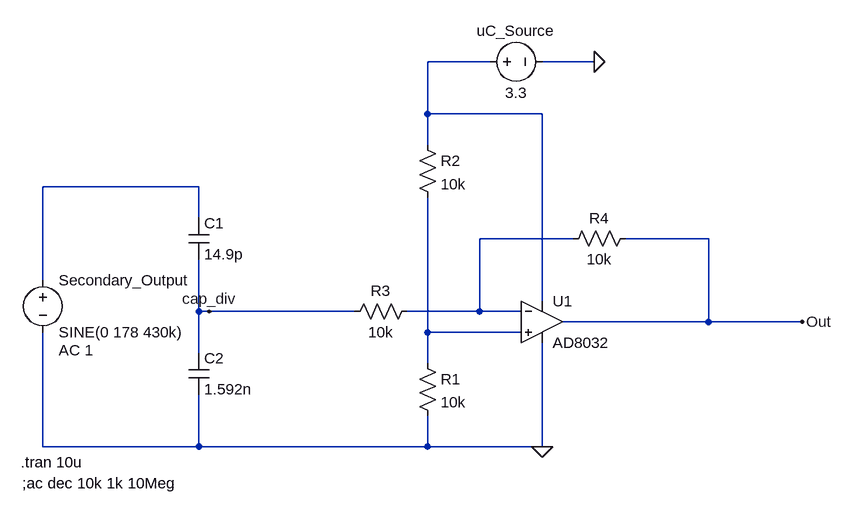
[diagram p0: schematic Volt_Sense_162V+10__1_24.asc]
Volt_Sense_162V+10__1_24.asc, the LTspice schematic file:
Version 4
SHEET 1 1100 680
WIRE 560 -176 464 -176
WIRE 720 -176 640 -176
WIRE 464 -96 464 -176
WIRE 640 -96 464 -96
WIRE 464 -48 464 -96
WIRE 112 16 -128 16
WIRE 112 64 112 16
WIRE 688 96 544 96
WIRE 896 96 768 96
WIRE -128 160 -128 16
WIRE 640 192 640 -96
WIRE 112 208 112 128
WIRE 128 208 112 208
WIRE 352 208 128 208
WIRE 544 208 544 96
WIRE 544 208 432 208
WIRE 608 208 544 208
WIRE 896 224 896 96
WIRE 896 224 672 224
WIRE 1040 224 896 224
WIRE 464 240 464 32
WIRE 608 240 464 240
WIRE 112 272 112 208
WIRE 464 288 464 240
WIRE -128 416 -128 240
WIRE 112 416 112 336
WIRE 112 416 -128 416
WIRE 464 416 464 368
WIRE 464 416 112 416
WIRE 640 416 640 256
WIRE 640 416 464 416
FLAG 640 416 0
FLAG 720 -176 0
FLAG 1040 224 Out
FLAG 128 208 cap_div
SYMBOL cap 96 64 R0
SYMATTR InstName C1
SYMATTR Value 14.9p
SYMBOL cap 96 272 R0
SYMATTR InstName C2
SYMATTR Value 1.592n
SYMBOL voltage -128 144 R0
WINDOW 123 24 124 Left 2
WINDOW 39 0 0 Left 0
SYMATTR InstName Secondary_Output
SYMATTR Value SINE(0 178 430k)
SYMATTR Value2 AC 1
SYMBOL OpAmps\\AD8032 640 160 R0
SYMATTR InstName U1
SYMBOL res 448 272 R0
SYMATTR InstName R1
SYMATTR Value 10k
SYMBOL res 448 -64 R0
SYMATTR InstName R2
SYMATTR Value 10k
SYMBOL res 336 224 R270
WINDOW 0 32 56 VTop 2
WINDOW 3 0 56 VBottom 2
SYMATTR InstName R3
SYMATTR Value 10k
SYMBOL res 672 112 R270
WINDOW 0 32 56 VTop 2
WINDOW 3 0 56 VBottom 2
SYMATTR InstName R4
SYMATTR Value 10k
SYMBOL voltage 544 -176 R270
WINDOW 0 32 56 VTop 2
WINDOW 3 -32 56 VBottom 2
SYMATTR InstName uC_Source
SYMATTR Value 3.3
TEXT -162 440 Left 2 !.tran 10u
TEXT -160 472 Left 2 !;ac dec 10k 1k 10Meg

The netlist it stands for:
* Volt_Sense_162V+10__1_24.asc
C1 N002 cap_div 14.9p
C2 cap_div 0 1.592n
V§Secondary_Output N002 0 SINE(0 178 430k) AC 1
XU1 N004 N003 N001 0 Out AD8032  ; pins In+ In- V+ V- OUT
R1 N004 0 10k
R2 N001 N004 10k
R3 cap_div N003 10k
R4 N003 Out 10k
V§uC_Source N001 0 3.3
.tran 10u
;ac dec 10k 1k 10Meg
.backanno
.end